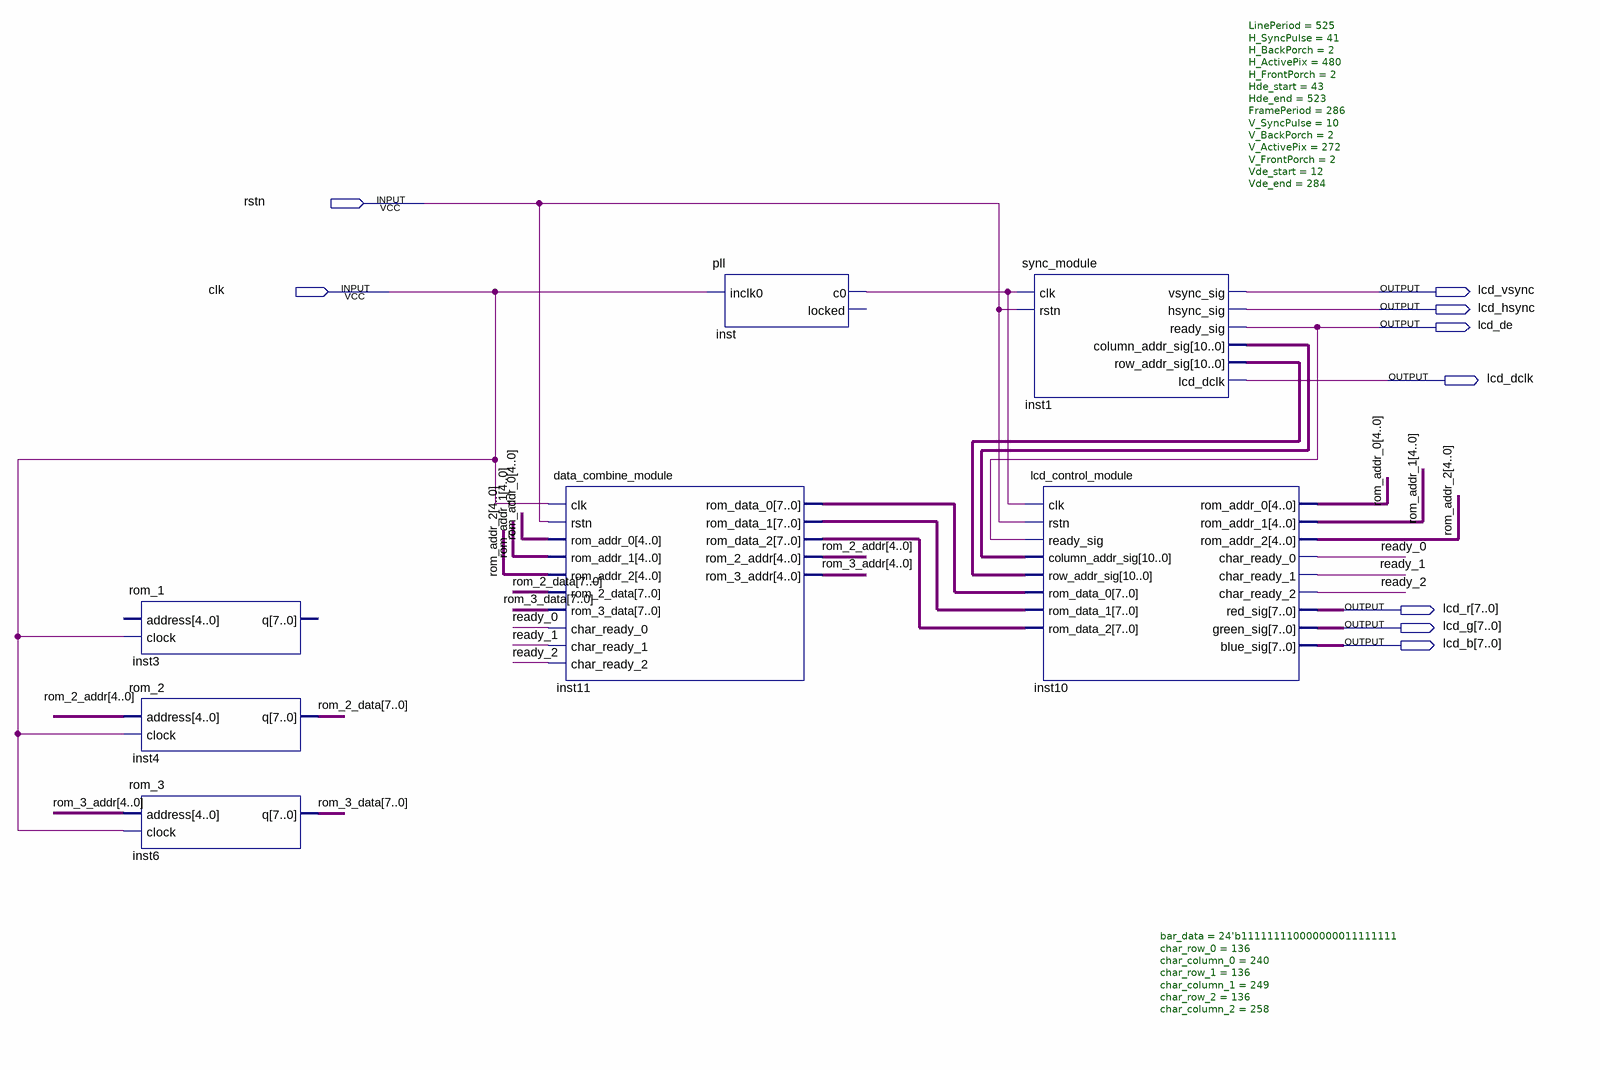
[diagram p0: schematic sheet]
// Quartus schematic top.bdf as structural Verilog: 7 symbols, 9 pins
module top (
  input  rstn,
  input  clk,
  output lcd_vsync,
  output lcd_hsync,
  output lcd_de,
  output lcd_dclk,
  output [7:0] lcd_r,
  output [7:0] lcd_g,
  output [7:0] lcd_b
);

  wire inst_c0, ready_0, ready_1, ready_2;
  wire [4:0] rom_2_addr, rom_3_addr, rom_addr_0, rom_addr_1, rom_addr_2;
  wire [7:0] inst11_rom_data_0, inst11_rom_data_1, inst11_rom_data_2, rom_2_data, rom_3_data;
  wire [10:0] inst1_column_addr_sig, inst1_row_addr_sig;

  rom_1 inst3 (.clock(clk));  // open: address, q
  rom_2 inst4 (.address(rom_2_addr), .clock(clk), .q(rom_2_data));
  rom_3 inst6 (.address(rom_3_addr), .clock(clk), .q(rom_3_data));
  data_combine_module inst11 (
    .clk(clk), .rstn(rstn), .rom_addr_0(rom_addr_0), .rom_addr_1(rom_addr_1), .rom_addr_2(rom_addr_2),
    .rom_2_data(rom_2_data), .rom_3_data(rom_3_data), .char_ready_0(ready_0), .char_ready_1(ready_1),
    .char_ready_2(ready_2), .rom_data_0(inst11_rom_data_0), .rom_data_1(inst11_rom_data_1),
    .rom_data_2(inst11_rom_data_2), .rom_2_addr(rom_2_addr), .rom_3_addr(rom_3_addr));
  pll inst (.inclk0(clk), .c0(inst_c0));  // open: locked
  sync_module #(.LinePeriod(525), .H_SyncPulse(41), .H_BackPorch(2), .H_ActivePix(480), .H_FrontPorch(2), .Hde_start(43), .Hde_end(523), .FramePeriod(286), .V_SyncPulse(10), .V_BackPorch(2), .V_ActivePix(272), .V_FrontPorch(2), .Vde_start(12), .Vde_end(284)) inst1 (
    .clk(inst_c0), .rstn(rstn), .vsync_sig(lcd_vsync), .hsync_sig(lcd_hsync), .ready_sig(lcd_de),
    .column_addr_sig(inst1_column_addr_sig), .row_addr_sig(inst1_row_addr_sig), .lcd_dclk(lcd_dclk));
  lcd_control_module #(.bar_data(24'b111111110000000011111111), .char_row_0(136), .char_column_0(240), .char_row_1(136), .char_column_1(249), .char_row_2(136), .char_column_2(258)) inst10 (
    .clk(inst_c0), .rstn(rstn), .ready_sig(lcd_de), .column_addr_sig(inst1_column_addr_sig),
    .row_addr_sig(inst1_row_addr_sig), .rom_data_0(inst11_rom_data_0), .rom_data_1(inst11_rom_data_1),
    .rom_data_2(inst11_rom_data_2), .rom_addr_0(rom_addr_0), .rom_addr_1(rom_addr_1),
    .rom_addr_2(rom_addr_2), .char_ready_0(ready_0), .char_ready_1(ready_1), .char_ready_2(ready_2),
    .red_sig(lcd_r), .green_sig(lcd_g), .blue_sig(lcd_b));
endmodule
